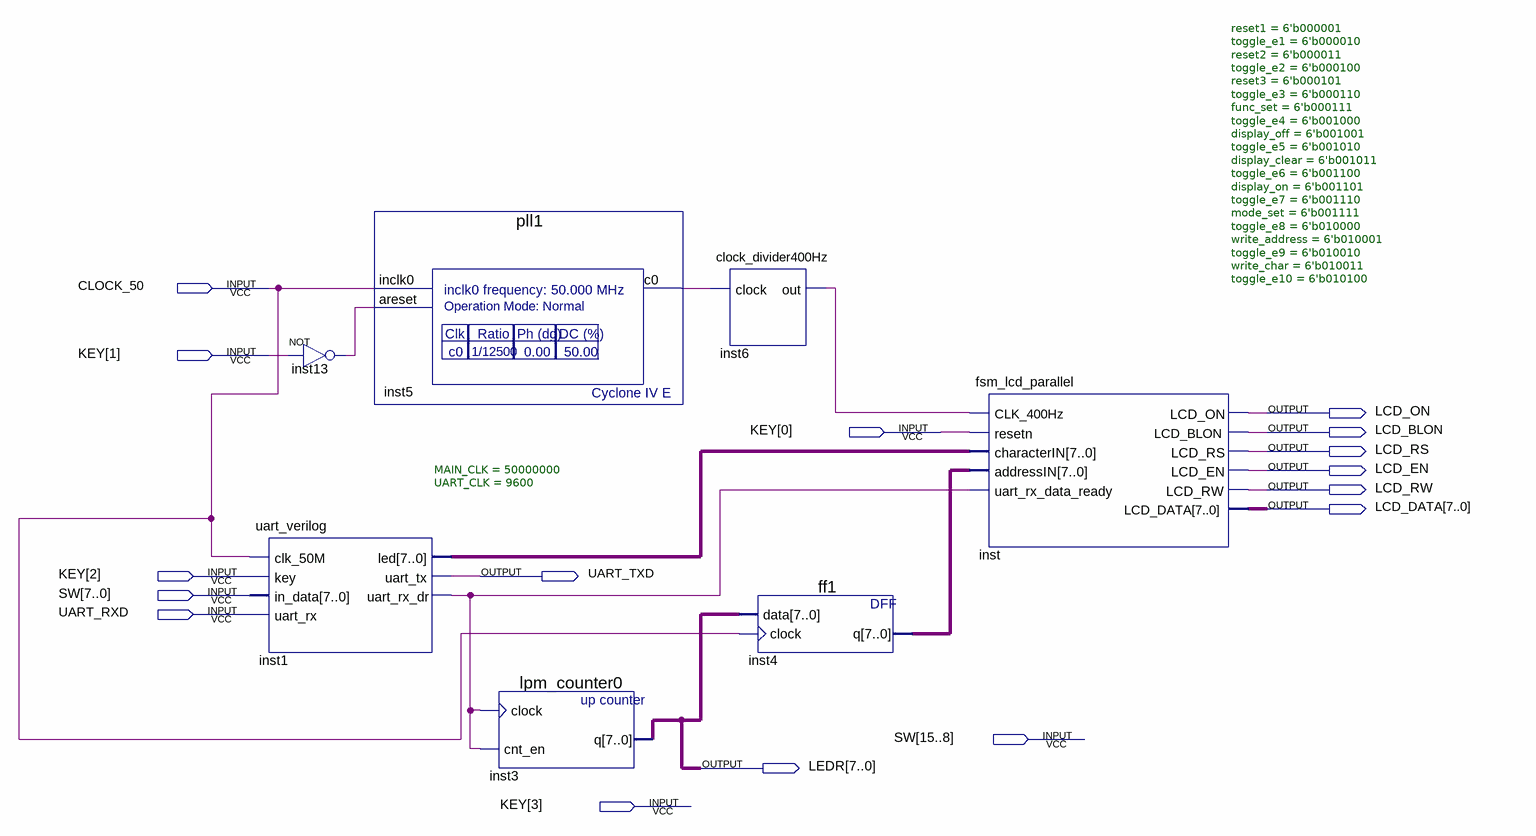
[diagram p0: schematic sheet]
// Quartus schematic lcd_parallel.bdf as structural Verilog: 7 symbols, 16 pins
module lcd_parallel (
  input  CLOCK_50,
  input  [3:0] KEY,
  input  [15:0] SW,
  input  UART_RXD,
  output LCD_ON,
  output LCD_BLON,
  output LCD_RS,
  output LCD_EN,
  output LCD_RW,
  output [7:0] LCD_DATA,
  output UART_TXD,
  output [7:0] LEDR
);

  wire inst1_uart_rx_dr, inst5_c0, inst6_out, inst13_out;
  wire [7:0] inst1_led, inst4_q;

  uart_verilog #(.MAIN_CLK(50000000), .UART_CLK(9600)) inst1 (
    .clk_50M(CLOCK_50), .key(KEY[2]), .in_data(SW[7:0]), .uart_rx(UART_RXD), .led(inst1_led),
    .uart_tx(UART_TXD), .uart_rx_dr(inst1_uart_rx_dr));
  not inst13 (inst13_out, KEY[1]);
  pll1 inst5 (.inclk0(CLOCK_50), .areset(inst13_out), .c0(inst5_c0));
  lpm_counter0 inst3 (.clock(inst1_uart_rx_dr), .cnt_en(inst1_uart_rx_dr), .q(LEDR));
  clock_divider400Hz inst6 (.clock(inst5_c0), .out(inst6_out));
  ff1 inst4 (.data(LEDR), .clock(CLOCK_50), .q(inst4_q));
  fsm_lcd_parallel #(.reset1(6'b000001), .toggle_e1(6'b000010), .reset2(6'b000011), .toggle_e2(6'b000100), .reset3(6'b000101), .toggle_e3(6'b000110), .func_set(6'b000111), .toggle_e4(6'b001000), .display_off(6'b001001), .toggle_e5(6'b001010), .display_clear(6'b001011), .toggle_e6(6'b001100), .display_on(6'b001101), .toggle_e7(6'b001110), .mode_set(6'b001111), .toggle_e8(6'b010000), .write_address(6'b010001), .toggle_e9(6'b010010), .write_char(6'b010011), .toggle_e10(6'b010100)) inst (
    .CLK_400Hz(inst6_out), .resetn(KEY[0]), .characterIN(inst1_led), .addressIN(inst4_q),
    .uart_rx_data_ready(inst1_uart_rx_dr), .LCD_ON(LCD_ON), .LCD_BLON(LCD_BLON), .LCD_RS(LCD_RS),
    .LCD_EN(LCD_EN), .LCD_RW(LCD_RW), .LCD_DATA(LCD_DATA));
endmodule
